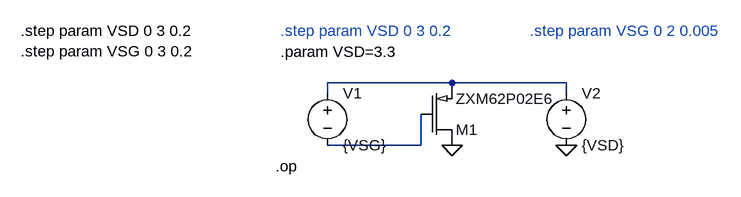
[diagram p0: schematic pMOStest3.asc]
pMOStest3.asc, the LTspice schematic file:
Version 4
SHEET 1 880 680
WIRE 176 128 -16 128
WIRE 352 128 176 128
WIRE -16 144 -16 128
WIRE 352 144 352 128
WIRE 128 224 128 176
WIRE 128 224 -16 224
FLAG 352 224 0
FLAG 176 224 0
SYMBOL voltage -16 128 R0
SYMATTR InstName V1
SYMATTR Value {VSG}
SYMBOL voltage 352 128 R0
SYMATTR InstName V2
SYMATTR Value {VSD}
SYMBOL PMOSbook 160 176 R0
SYMATTR Value ZXM62P02E6
SYMATTR InstName M1
TEXT -488 48 Left 0 !.step param VSD 0 3 0.2\n.step param VSG 0 3 0.2
TEXT -96 256 Left 0 !.op
TEXT -88 48 Left 0 ;.step param VSD 0 3 0.2
TEXT 296 48 Left 0 ;.step param VSG 0 2 0.005
TEXT -88 80 Left 0 !.param VSD=3.3

The netlist it stands for:
* pMOStest3.asc
V1 N001 N002 {VSG}
V2 N001 0 {VSD}
M1 0 N002 N001 N001 ZXM62P02E6
.model NMOS NMOS
.model PMOS PMOS
.lib standard.mos
.step param VSD 0 3 0.2
.step param VSG 0 3 0.2
.op
* .step param VSD 0 3 0.2
* .step param VSG 0 2 0.005
.param VSD=3.3
.backanno
.end